# EAGLE design Adafruit_ADS1115_16Bit_I2C_ADC (EAGLE 6.2)
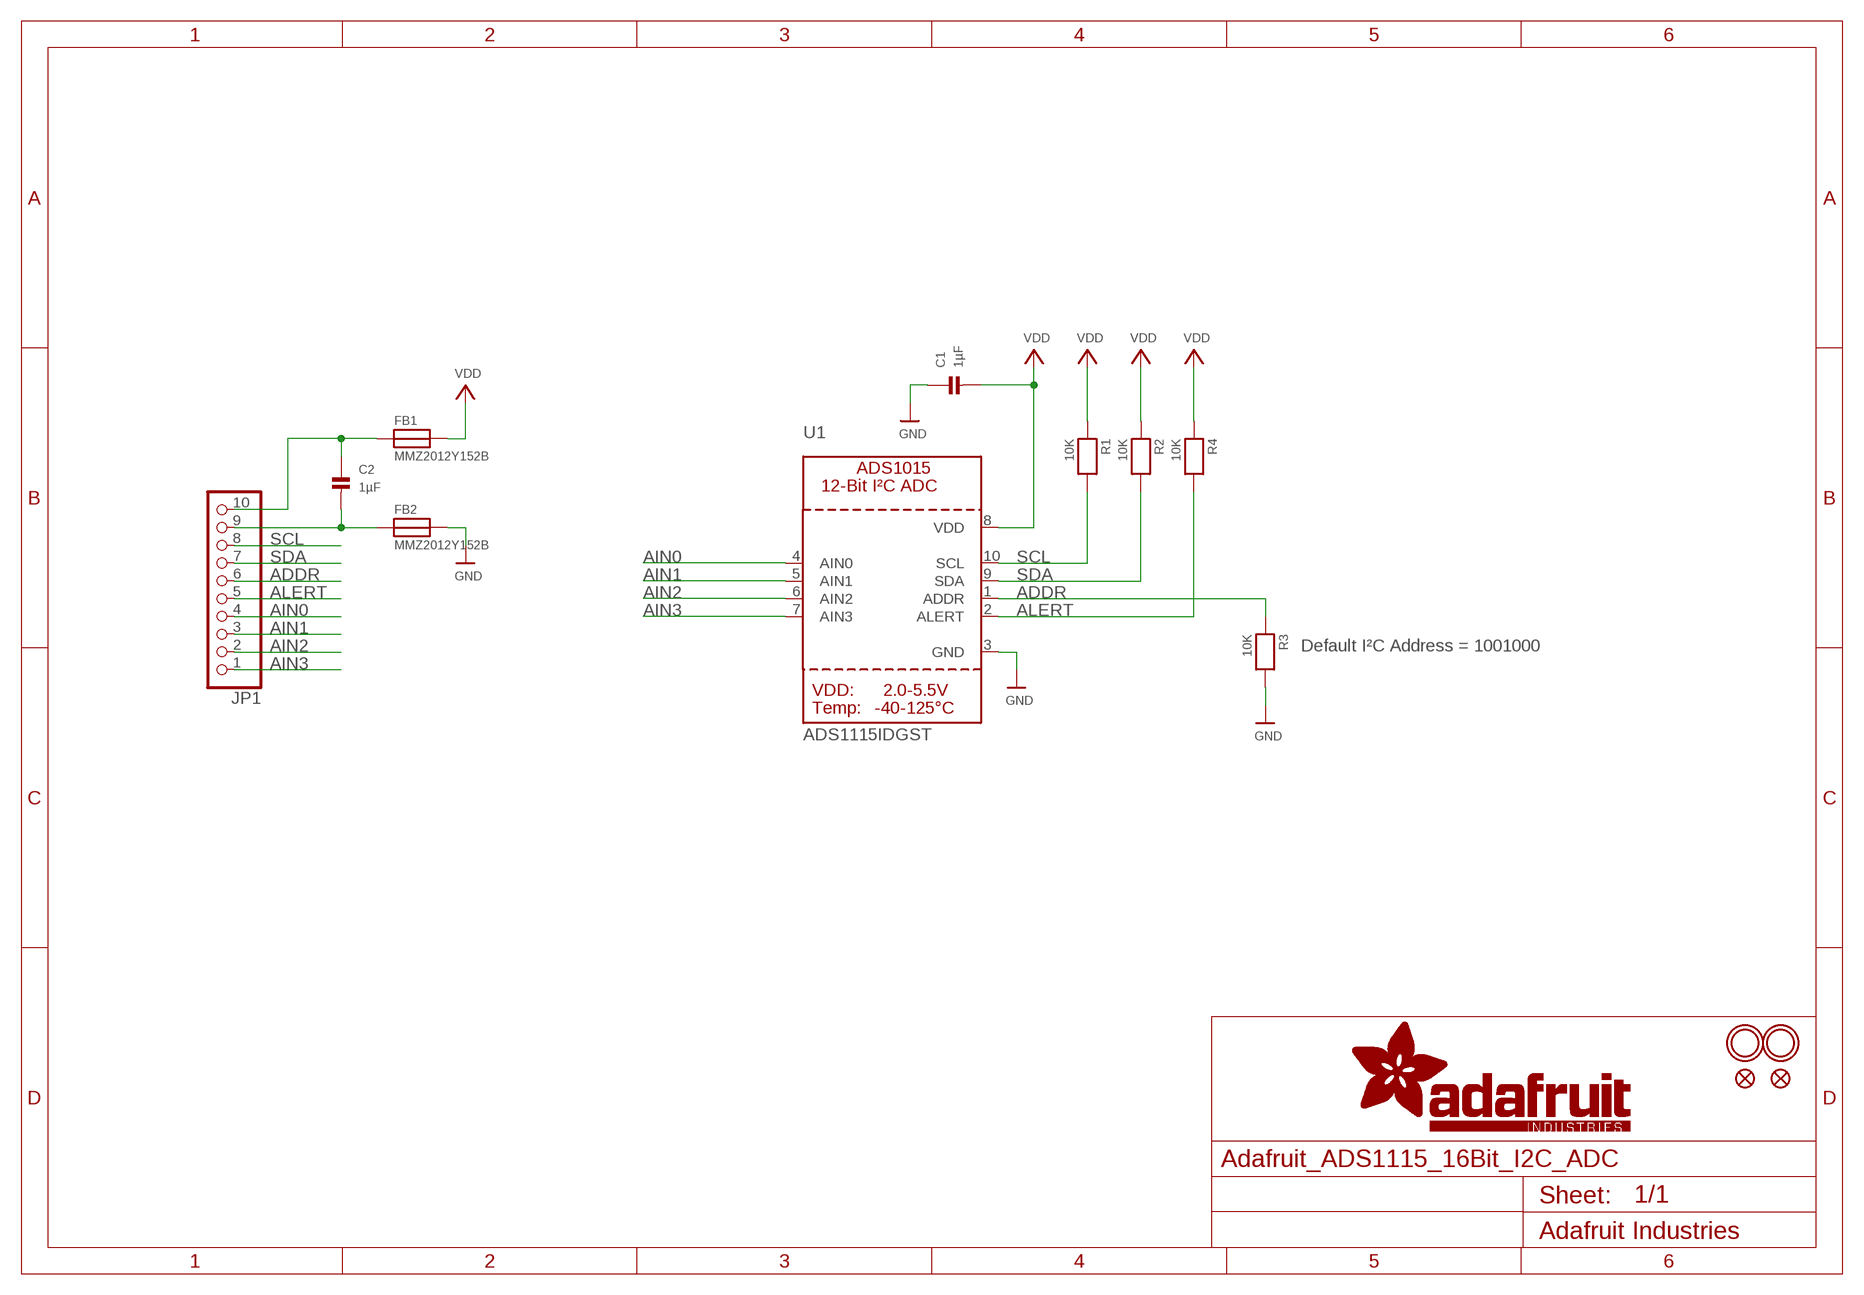
[diagram p0: schematic, sheet 1]

## Parts
C1  1µF  CAP_CERAMIC0805  [0805]
C2  1µF  CAP_CERAMIC0805  [0805]
FB1  MMZ2012Y152B  FERRITE0805  [0805]
FB2  MMZ2012Y152B  FERRITE0805  [0805]
FID1  FIDUCIAL""  [FIDUCIAL_1MM]
FID2  FIDUCIAL""  [FIDUCIAL_1MM]
JP1  HEADER-1X1070MIL  [1X10_ROUND70]
R1  10K  RESISTOR0805  [0805]
R2  10K  RESISTOR0805  [0805]
R3  10K  RESISTOR0805  [0805]
R4  10K  RESISTOR0805  [0805]
U1  ADS1115IDGST  ADC_ADS1015  [MSOP10]
U$13  MOUNTINGHOLE2.5  [MOUNTINGHOLE_2.5_PLATED]
U$14  MOUNTINGHOLE2.5  [MOUNTINGHOLE_2.5_PLATED]

## Nets
ADDR: JP1.6 R3.1 U1.1(ADDR)
AIN0: JP1.4 U1.4(AIN0)
AIN1: JP1.3 U1.5(AIN1)
AIN2: JP1.2 U1.6(AIN2)
AIN3: JP1.1 U1.7(AIN3)
ALERT: JP1.5 R4.2 U1.2(ALERT)
GND: C1.1 FB2.2 R3.2 U1.3(GND)
N$1: C2.1 FB1.1 JP1.10
N$2: C2.2 FB2.1 JP1.9
SCL: JP1.8 R1.2 U1.10(SCL)
SDA: JP1.7 R2.2 U1.9(SDA)
VDD: C1.2 FB1.2 R1.1 R2.1 R4.1 U1.8(VDD)

## Notes on the sheet
- Default I²C Address = 1001000

## Library data of the parts
C1 C2 = microbuilder:CAP_CERAMIC: Ceramic Capacitors 0402 - 0402 Surface Mount Capacitors 16pF 50V 5% [Digikey: 445-4899-2-ND] 18pF 50V 5% [Digikey: 490-1281-2-ND] 22pF 50V 5% [Digikey: 490-1283-2-ND] 68pF 50V 5% [Digikey: 490-1289-2-ND] 0.1uF 10V 10% [Digikey: 490-1318-2-ND] 1.0uF 6.3V 10% [Digikey: 490-1320-2-ND] 0603 - 0603 Surface Mount Capacitors 16 pF 50V 5% [Digikey: 445-5051-2-ND] 22 pF 50V [Digikey: PCC220ACVTR-ND] 33 pF 50V 5% [Digikey: 490-1415-1-ND] 56pF 50V 5% [Digikey: 490-1421-1-ND] 220pF 50V 5% [Digikey: 445-1285-1-ND] 680 pF 50V 2200 pF 50V 5% C0G [Digikey: 445-1297-1-ND] 5600 pF 100V 5% X7R [Digikey: 478-3711-1-ND] 0.1 µF 25V 10% [Digikey: PCC2277TR-ND] 0.22 µF 16V 10% X7R [Digikey: 445-1318-1-ND] 1.0 µF 25V 10% [Digikey: 445-5146-2-ND] 0603 - RF Specific 3pF 250V +/-0.1pF RF [Digikey: 712-1347-1-ND] 18 pF 250V 5% [Digikey: 478-3505-1-ND or 712-1322-1-ND] 56 pF 250V 5% C0G RF [Digikey: 490-4867-1-ND] 68 pF 250V RF [Digikey: 490-4868-1-ND] 0805 - 0805 Surface Mount Capacitors 220 pF 250V 2% RF Ceramic Capacitor [Digikey: 712-1398-1-ND] 1000 pF 50V 2% NP0 Ceramic Capacitor [Digikey: 478-3760-1-ND] 0.1 µF 25V 10% Ceramic Capacitor [Digikey: PCC1828TR-ND] 1.0 µF 16V 10% Ceramic Capacitor[Digikey: 490-1691-2-ND] 10.0 µF 10V 10% Ceramic Capacitor[Digikey: 709-1228-1-ND] 10.0 uF 16V 10% Ceramic Capacitor [Digikey: 478-5165-2-ND] 47 uF 6.3V 20% Ceramic Capacitor [Digikey: 587-1779-1-ND or 399-5506-1-ND] 1206 - 1206 Surface Mount Capacitors 47uF 10V 20% Ceramic Capacitor [Digikey: 490-5528-1-ND or 399-5508-1-ND or 445-6010-1-ND] 100uF 6.3V -20%, +80% Y5V Ceramic Capacitor (Digikey: 490-4512-1-ND, Mouser: 81-GRM31CF50J107ZE1L)
FB1 FB2 = microbuilder:FERRITE: Ferrite Bead 0603 MMZ1608B121C - 120 Ohm, 600mA Ferrite Chip - Digikey: 445-2164-1-ND BK1608HW121-T - 120 Ohm, 600mA Ferrite Chip - Digikey: 587-1876-2-ND 0805 HZ0805B272R-10 - 2.7K Ohm @ 100MHz, 200mA 0.8 Ohm DC Resistance - Digikey: 240-2504-1-ND (see also Murata BLM21BD272SN1L)
FID1 FID2 = microbuilder:FIDUCIAL: Fiducial Alignment Points Various fiducial points for machine vision alignment.
JP1 = microbuilder:HEADER-1X10: PIN HEADER
R1-R4 = microbuilder:RESISTOR: Resistors 0402 - 0402 Surface Mount Package 22 Ohm 1% 1/16W [Digikey: 311-22.0LRTR-ND] 33 Ohm 5% 1/16W 1.0K 5% 1/16W 1.5K 5% 1/16W 2.0K 1% 1/16W 10.0K 1% 1/16W [Digikey: 311-10.0KLRTR-ND] 10.0K 5% 1/16W [Digikey: RMCF0402JT10K0TR-ND] 12.1K 1% 1/16W [Digikey: 311-22.0LRTR-ND] 100.0K 5% 1/16W 0603 - 0603 Surface Mount Package 0 Ohm 1/10 Watt 1% Resistor 15 Ohm 1/10 Watt 1% Resistor 33 Ohm 1/10 Watt 1% Resistor 49.9 Ohm 1/10 Watt 1% Resistor 100 Ohm 1/10 Watt 1% Resistor 150 Ohm 1/10 Watt 1% Resistor 240 Ohm 1/10 Watt 1% Resistor 390 Ohm 1/10 Watt 1% Resistor 560 Ohm 1/10 Watt 1% Resistor 680 Ohm 1/10 Watt 1% Resistor 750 Ohm 1/10 Watt 1% Resistor 1.0K Ohm 1/10 Watt 1% Resistor 1.5K Ohm 1/10 Watt 1% Resistor 2.0K Ohm 1/10 Watt 1% Resistor 2.2K Ohm 1/10 Watt 1% Resistor 3.3K Ohm 1/10 Watt 1% Resistor 4.7K Ohm 1/10 Watt 1% Resistor 10.0K Ohm 1/10 Watt 1% Resistor 12.0K Ohm 1/10 Watt 1% Resistor 12.1K Ohm 1/10 Watt 1% Resistor 20.0K Ohm 1/10 Watt 1% Resistor 33.0K Ohm 1/10 Watt 1% Resistor 100.0K Ohm 1/10 Watt 1% Resistor 0805 - 0805 Surface Mount Package 0 Ohm 1/8 Watt 1% Resistor 33 Ohm 1/8 Watt 1% Resistor 100 Ohm 1/8 Watt 1% Resistor 150 Ohm 1/8 Watt 1% Resistor 200 Ohm 1/8 Watt 1% Resistor 240 Ohm 1/8 Watt 1% Resistor 330 Ohm 1/8 Watt 1% Resistor 390 Ohm 1/8 Watt 1% Resistor 470 Ohm 1/8 Watt 1% Resistor 1.0K Ohm 1/8 Watt 1% Resistor 1.5K Ohm 1/8 Watt 1% Resistor 2.0K Ohm 1/8 Watt 1% Resistor 4.7K Ohm 1/8 Watt 1% Resistor 5.1K Ohm 1/8 Watt 1% Resistor 5.6K Ohm 1/8 Watt 1% Resistor 10.0K Ohm 1/8 Watt 1% Resistor 22.0K Ohm 1/8 Watt 1% Resistor 33.0K Ohm 1/8 Watt 1% Resistor 100K Ohm 1/8 Watt 1% Resistor 1206 - 1206 Surface Mount Package 2012 - 2010 Surface Mount Package 0.11 Ohm 1/2 Watt 1% Resistor - Digikey: RHM.11UCT-ND
U1 = microbuilder:ADC_ADS1015: ADS1015 - 12-bit 4-Channel I2C ADC with Internal PGA VDD: 2.0-5.5V Sampling Rate: 3.3ksps Gain Settings: 2/3, 1, 2, 4, 8, 16 I2C Address: ADDR low = 1001000x, ADDR high = 1001001x Internal Comparator The ADS1015 includes an internal comparator that can be set to output a high-level on ALERT when the conversion results exceeeds a pre-defined upper level, and will deassert itself when the level falls below a pre-defined lower threshold level. It can also be set to windowed mode where the ALERT pin will be asserted if the data exceeds the upper threshold or falls below the lower threshold.
U$13 U$14 = microbuilder:MOUNTINGHOLE: Mounting Hole For #2 screws (0.086"/2.18mm width, 0.094"/2.4mm hole) use 2.5mm

## Board
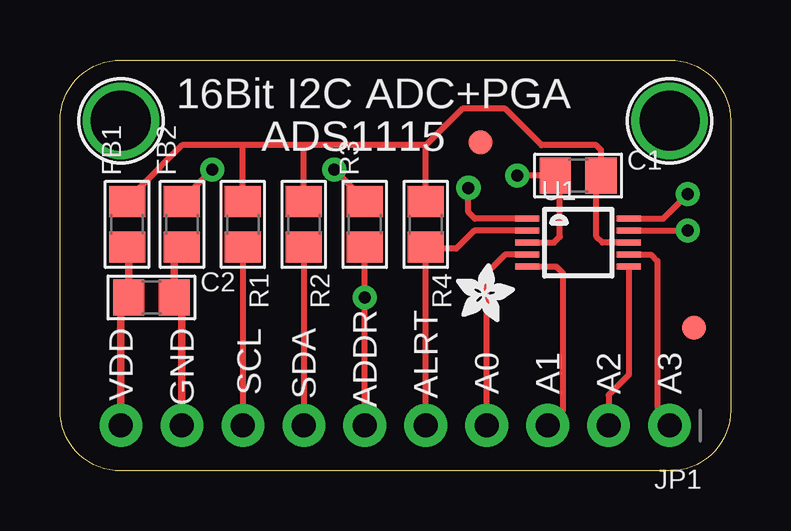
[diagram p1: board, top side]
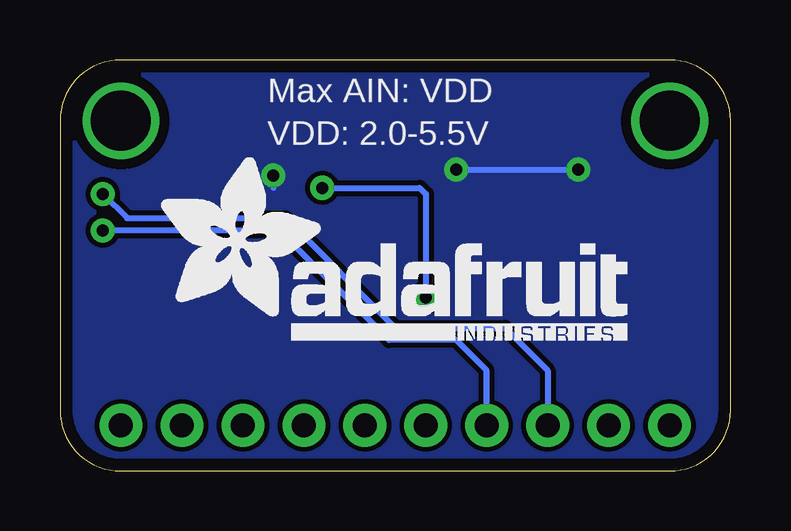
[diagram p2: board, bottom side, seen from below]

Size 27.94 x 17.14 mm. Coordinates in mm from the lower left corner, seen from the top.
Outline: 27.94,14.61 27.94,2.54 arc-90 25.4,0 2.54,0 arc-90 0,2.54 0,14.61 arc-90 2.54,17.14 25.4,17.14 arc-90 27.94,14.61
Copper layers (1*16): Top 0.035mm / dielectric 1.5mm / Bottom 0.035mm
Design rules: minimum track width 8mil, minimum drill 0.4mm, track to track 8mil, track to pad 8mil, pad to pad 8mil, via to via 8mil, smd to smd 8mil, copper to edge 20mil, drill to drill 8mil, minimum pad ring 8mil, minimum via ring 10mil, stop-mask expansion 3mil, vias tented up to drill 20mil, thermal gap 8mil

### Footprints (pad centres in the part's own frame; a part is rotated, then mirrored left to right if it is on the bottom)
0805 = smd 1.3 x 1.5: 1 -0.95,0; 2 0.95,0
FIDUCIAL_1MM = smd 1 x 1: 1 0,0
1X10_ROUND70 = drill 1 pad 1.778: 1 -11.43,0; 2 -8.89,0; 3 -6.35,0; 4 -3.81,0; 5 -1.27,0; 6 1.27,0; 7 3.81,0; 8 6.35,0; 9 8.89,0; 10 11.43,0
MSOP10 = smd 0.25 x 1: 1 -1,-2.113; 2 -0.5,-2.113; 3 0,-2.113; 4 0.5,-2.113; 5 1,-2.113; 6 1,2.113; 7 0.5,2.113; 8 0,2.113; 9 -0.5,2.113; 10 -1,2.113
MOUNTINGHOLE_2.5_PLATED = drill 2.5 pad 3.2: P$1 0,0

### Placement (x,y rotation side)
C1  21.59,12.32 0 top
C2  3.81,7.24 0 top
FB1  2.79,10.29 90 top
FB2  5.08,10.29 90 top
FID1  26.42,5.97 180 top
FID2  17.53,13.72 180 top
JP1  13.97,1.91 180 top
R1  7.62,10.29 270 top
R2  10.16,10.29 270 top
R3  12.7,10.29 90 top
R4  15.24,10.29 270 top
U1  21.59,9.53 270 top
U$13  25.4,14.61 180 top
U$14  2.54,14.61 180 top
U$15  [ADAFRUIT_TEXT_20MM]  23.88,5.46 0 bottom
U$16  [ADAFRUIT_2.5MM]  16.51,6.22 0 top

### Tracks (layer width: path | path; a pad name or v marks a point on that pad's centre or on a via)
ADDR  (via drill 0.5)
  Top 0.254: U1.1 17.29,10.53 17.02,10.79 v17.02,11.81 | JP1.6 v12.7,7.24 R3.1
  Bottom 0.254: v17.02,11.81 12.95,11.81 12.7,11.56 v12.7,7.24
AIN0
  Top 0.254: U1.4 18.55,9.03 17.78,8.26 JP1.4
AIN1
  Top 0.254: U1.5 20.68,8.53 20.95,8.26 20.95,2.54 JP1.3
AIN2
  Top 0.254: U1.6 23.7,4.02 22.86,3.17 JP1.2
AIN3
  Top 0.254: U1.7 24.63,9.03 24.89,8.76 24.89,2.67 JP1.1
ALERT
  Top 0.254: JP1.5 R4.2 15.31,9.27 16.51,9.27 17.26,10.03 U1.2
GND  (via drill 0.5)
  Top 0.254: FB2.2 5.08,11.3 v6.35,12.57 | R3.2 12.7,11.3 v11.43,12.57 | v19.05,12.32 C1.1 20.83,12.13 20.83,9.78 20.57,9.53 U1.3
  Bottom 0.254: v11.43,12.57 v6.35,12.57 | v19.05,12.32 19.05,11.81
  pour Bottom: 27.94,17.14 27.94,0 0,0 0,17.14
N$1
  Top 0.305: JP1.10 2.54,6.92 C2.1 2.86,9.27 FB1.1
N$2
  Top 0.305: JP1.9 5.08,6.92 C2.2 4.76,9.02 FB2.1
SCL  (via drill 0.5)
  Top 0.254: U1.10 25.13,10.53 v26.16,11.56 | R1.2 JP1.8
  Bottom 0.254: v26.16,11.56 25.15,10.54 18.54,10.54 13.97,5.97 9.4,5.97 7.62,4.19 JP1.8
SDA  (via drill 0.5)
  Top 0.254: U1.9 26.15,10.03 v26.16,10.03 | R2.2 JP1.7
  Bottom 0.254: JP1.7 10.16,4.19 11.43,5.46 14.22,5.46 18.8,10.03 v26.16,10.03
VDD
  Top 0.254: U1.8 22.61,9.53 22.35,9.78 22.35,12.13 C1.2 | 15.24,13.59 10.16,13.59 | 10.16,13.59 7.62,13.59 | R1.1 7.62,13.59 | R2.1 10.16,13.59 | 7.62,13.59 5.08,13.59 3.3,11.81 3.3,11.75 FB1.2 | R4.1 15.24,13.59 | 15.24,13.59 16.76,15.11 18.54,15.11 20.07,13.59 22.35,13.59 22.54,13.4 C1.2 | 22.79,12.07 C1.2

### Text on the board
tPlace: 16Bit I2C ADC+PGA | ADS1115 | ADDR | ALRT | VDD | GND | SCL | SDA | A0 | A1 | A2 | A3
bPlace: Max AIN: VDD | VDD: 2.0-5.5V